# Altium schematic sheet CF_FMC_ABC.SchDoc
size Tabloid; DocumentNumber: 9; SheetNumber: 9; SheetTotal: 10; Sheet_Name: CF_FMC_ABC; Size: 11x17
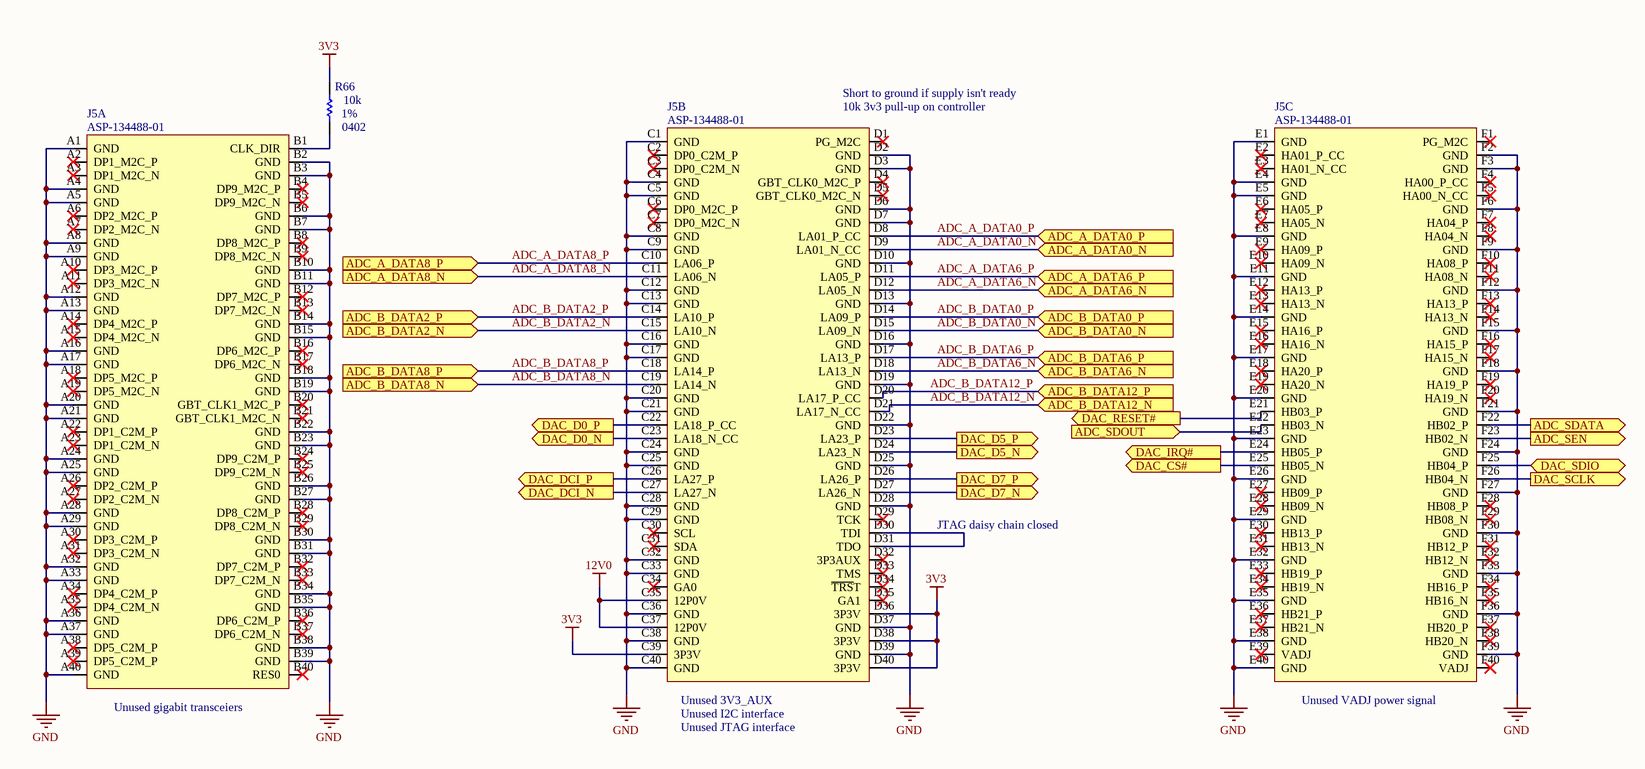
[diagram p0: CF_FMC_ABC.SchDoc]

## Parts
J5  ASP-134488-01  [CONN_SAMTEC_ASP-134488-01]  (parts A,B,C of 5)
R66  value 10k  Package: 0402  Precision: 1%  [RES_0402]  (hidden comment: RES - 0402)

## Ports
ADC_A_DATA0_N (in), ADC_A_DATA0_P (in), ADC_A_DATA6_N (in), ADC_A_DATA6_P (in), ADC_A_DATA8_N (in), ADC_A_DATA8_P (in), ADC_B_DATA0_N (in), ADC_B_DATA0_P (in), ADC_B_DATA2_N (in), ADC_B_DATA2_P (in), ADC_B_DATA6_N (in), ADC_B_DATA6_P (in), ADC_B_DATA8_N (in), ADC_B_DATA8_P (in), ADC_B_DATA12_N (in), ADC_B_DATA12_P (in), ADC_SDATA (out), ADC_SDOUT (in), ADC_SEN (out), DAC_CS# (out), DAC_D0_N (out), DAC_D0_P (out), DAC_D5_N (out), DAC_D5_P (out), DAC_D7_N (out), DAC_D7_P (out), DAC_DCI_N (out), DAC_DCI_P (out), DAC_IRQ# (out), DAC_RESET# (out), DAC_SCLK (out), DAC_SDIO (bidir)

## Nets
3V3: J5.C39(3P3V) J5.D36(3P3V) J5.D38(3P3V) J5.D40(3P3V) R66.2
12V0: J5.C35(12P0V) J5.C37(12P0V)
GND: J5.A1(GND) J5.A4(GND) J5.A5(GND) J5.A8(GND) J5.A9(GND) J5.A12(GND) J5.A13(GND) J5.A16(GND) J5.A17(GND) J5.A20(GND) J5.A21(GND) J5.A24(GND) J5.A25(GND) J5.A28(GND) J5.A29(GND) J5.A32(GND) J5.A33(GND) J5.A36(GND) J5.A37(GND) J5.A40(GND) J5.B2(GND) J5.B3(GND) J5.B6(GND) J5.B7(GND) J5.B10(GND) J5.B11(GND) J5.B14(GND) J5.B15(GND) J5.B18(GND) J5.B19(GND) J5.B22(GND) J5.B23(GND) J5.B26(GND) J5.B27(GND) J5.B30(GND) J5.B31(GND) J5.B34(GND) J5.B35(GND) J5.B38(GND) J5.B39(GND) J5.C1(GND) J5.C4(GND) J5.C5(GND) J5.C8(GND) J5.C9(GND) J5.C12(GND) J5.C13(GND) J5.C16(GND) J5.C17(GND) J5.C20(GND) J5.C21(GND) J5.C24(GND) J5.C25(GND) J5.C28(GND) J5.C29(GND) J5.C32(GND) J5.C33(GND) J5.C36(GND) J5.C38(GND) J5.C40(GND) J5.D2(GND) J5.D3(GND) J5.D6(GND) J5.D7(GND) J5.D10(GND) J5.D13(GND) J5.D16(GND) J5.D19(GND) J5.D22(GND) J5.D25(GND) J5.D28(GND) J5.D37(GND) J5.D39(GND) J5.E1(GND) J5.E4(GND) J5.E5(GND) J5.E8(GND) J5.E11(GND) J5.E14(GND) J5.E17(GND) J5.E20(GND) J5.E23(GND) J5.E26(GND) J5.E29(GND) J5.E32(GND) J5.E35(GND) J5.E38(GND) J5.E40(GND) J5.F2(GND) J5.F3(GND) J5.F6(GND) J5.F9(GND) J5.F12(GND) J5.F15(GND) J5.F18(GND) J5.F21(GND) J5.F24(GND) J5.F27(GND) J5.F30(GND) J5.F33(GND) J5.F36(GND) J5.F39(GND)
ADC_A_DATA0_N: J5.D9(LA01_N_CC) ; port ADC_A_DATA0_N
ADC_A_DATA0_P: J5.D8(LA01_P_CC) ; port ADC_A_DATA0_P
ADC_A_DATA6_N: J5.D12(LA05_N) ; port ADC_A_DATA6_N
ADC_A_DATA6_P: J5.D11(LA05_P) ; port ADC_A_DATA6_P
ADC_A_DATA8_N: J5.C11(LA06_N) ; port ADC_A_DATA8_N
ADC_A_DATA8_P: J5.C10(LA06_P) ; port ADC_A_DATA8_P
ADC_B_DATA0_N: J5.D15(LA09_N) ; port ADC_B_DATA0_N
ADC_B_DATA0_P: J5.D14(LA09_P) ; port ADC_B_DATA0_P
ADC_B_DATA2_N: J5.C15(LA10_N) ; port ADC_B_DATA2_N
ADC_B_DATA2_P: J5.C14(LA10_P) ; port ADC_B_DATA2_P
ADC_B_DATA6_N: J5.D18(LA13_N) ; port ADC_B_DATA6_N
ADC_B_DATA6_P: J5.D17(LA13_P) ; port ADC_B_DATA6_P
ADC_B_DATA8_N: J5.C19(LA14_N) ; port ADC_B_DATA8_N
ADC_B_DATA8_P: J5.C18(LA14_P) ; port ADC_B_DATA8_P
ADC_B_DATA12_N: J5.D21(LA17_N_CC) ; port ADC_B_DATA12_N
ADC_B_DATA12_P: J5.D20(LA17_P_CC) ; port ADC_B_DATA12_P
ADC_SDATA: J5.F22(HB02_P) ; port ADC_SDATA
ADC_SDOUT: J5.E22(HB03_N) ; port ADC_SDOUT
ADC_SEN: J5.F23(HB02_N) ; port ADC_SEN
DAC_CS#: J5.E25(HB05_N) ; port DAC_CS#
DAC_D0_N: J5.C23(LA18_N_CC) ; port DAC_D0_N
DAC_D0_P: J5.C22(LA18_P_CC) ; port DAC_D0_P
DAC_D5_N: J5.D24(LA23_N) ; port DAC_D5_N
DAC_D5_P: J5.D23(LA23_P) ; port DAC_D5_P
DAC_D7_N: J5.D27(LA26_N) ; port DAC_D7_N
DAC_D7_P: J5.D26(LA26_P) ; port DAC_D7_P
DAC_DCI_N: J5.C27(LA27_N) ; port DAC_DCI_N
DAC_DCI_P: J5.C26(LA27_P) ; port DAC_DCI_P
DAC_IRQ#: J5.E24(HB05_P) ; port DAC_IRQ#
DAC_RESET#: J5.E21(HB03_P) ; port DAC_RESET#
DAC_SCLK: J5.F26(HB04_N) ; port DAC_SCLK
DAC_SDIO: J5.F25(HB04_P) ; port DAC_SDIO
NetJ5_B1: J5.B1(CLK_DIR) R66.1
NetJ5_D30: J5.D30(TDI) J5.D31(TDO)

Not connected (* = marked no-connect by the designer): J5 A2(DP1_M2C_P)* A3(DP1_M2C_N)* A6(DP2_M2C_P)* A7(DP2_M2C_N)* A10(DP3_M2C_P)* A11(DP3_M2C_N)* A14(DP4_M2C_P)* A15(DP4_M2C_N)* A18(DP5_M2C_P)* A19(DP5_M2C_N)* A22(DP1_C2M_P)* A23(DP1_C2M_N)* A26(DP2_C2M_P)* A27(DP2_C2M_N)* A30(DP3_C2M_P)* A31(DP3_C2M_N)* A34(DP4_C2M_P)* A35(DP4_C2M_N)* A38(DP5_C2M_P)* A39(DP5_C2M_P)* B4(DP9_M2C_P)* B5(DP9_M2C_N)* B8(DP8_M2C_P)* B9(DP8_M2C_N)* B12(DP7_M2C_P)* B13(DP7_M2C_N)* B16(DP6_M2C_P)* B17(DP6_M2C_N)* B20(GBT_CLK1_M2C_P)* B21(GBT_CLK1_M2C_N)* B24(DP9_C2M_P)* B25(DP9_C2M_N)* B28(DP8_C2M_P)* B29(DP8_C2M_N)* B32(DP7_C2M_P)* B33(DP7_C2M_N)* B36(DP6_C2M_P)* B37(DP6_C2M_N)* B40(RES0)* C2(DP0_C2M_P)* C3(DP0_C2M_N)* C6(DP0_M2C_P)* C7(DP0_M2C_N)* C30(SCL)* C31(SDA)* C34(GA0)* D1(PG_M2C)* D4(GBT_CLK0_M2C_P)* D5(GBT_CLK0_M2C_N)* D29(TCK)* D32(3P3AUX)* D33(TMS)* D34(~{TRS}T)* D35(GA1)* E2(HA01_P_CC)* E3(HA01_N_CC)* E6(HA05_P)* E7(HA05_N)* E9(HA09_P)* E10(HA09_N)* E12(HA13_P)* E13(HA13_N)* E15(HA16_P)* E16(HA16_N)* E18(HA20_P)* E19(HA20_N)* E27(HB09_P)* E28(HB09_N)* E30(HB13_P)* E31(HB13_N)* E33(HB19_P)* E34(HB19_N)* E36(HB21_P)* E37(HB21_N)* E39(VADJ)* F1(PG_M2C)* F4(HA00_P_CC)* F5(HA00_N_CC)* F7(HA04_P)* F8(HA04_N)* F10(HA08_P)* F11(HA08_N)* F13(HA13_P)* F14(HA13_N)* F16(HA15_P)* F17(HA15_N)* F19(HA19_P)* F20(HA19_N)* F28(HB08_P)* F29(HB08_N)* F31(HB12_P)* F32(HB12_N)* F34(HB16_P)* F35(HB16_N)* F37(HB20_P)* F38(HB20_N)* F40(VADJ)*

## Notes on the sheet
- (near J5) Short to ground if supply isn't ready
- (near J5) 10k 3v3 pull-up on controller
- JTAG daisy chain closed
- (near J5) Unused gigabit transceiers
- (near J5) Unused 3V3_AUX
- (near J5) Unused I2C interface
- Unused JTAG interface
- (near J5) Unused VADJ power signal
- Sheet Name
- Project Title
- Global Project
- Size
- Group
- Revision
- Date
- Sheet
- of
- Filename
- Designers

## Library data of the parts
J5 = CONN_SAMTEC_ASP-134488-01: CONN - VITA 57 MEZZ MALE (DAUGHTERBOARD) HIGH DENSITY - SMD-400; Voltage: 240VAC; Current: 1.8A; Mfg: Samtec; Power: *; Mfg Part Number: ASP-134488-01; HelpURL: http://suddendocs.samtec.com/prints/asp-134488-01-mkt.pdf; CreatedBy: Jonathan Bouchard; Temperature: -55 °C to +125 °C; Value: *; Precision: *; Package: SMD-400
R66 = RES - 0402: Voltage: 50V; Power: 1/16W; Current: *; CreatedBy: Jonathan Bouchard